# Altium schematic sheet UARTtoRS485.SchDoc
size A
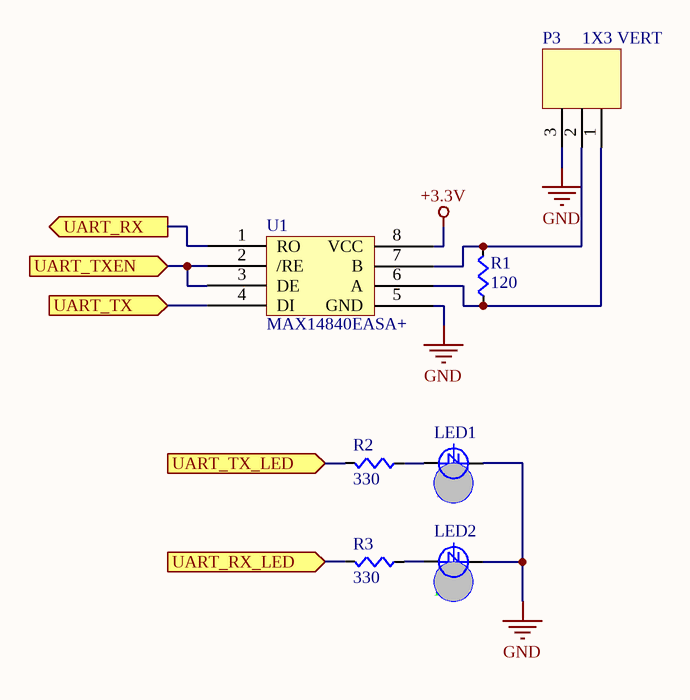
[diagram p0: UARTtoRS485.SchDoc]

## Parts
LED1  Color: TX  [LED0603]  (hidden comment: LED)
LED2  Color: RX  [LED0603]  (hidden comment: LED)
P3  1X3 VERT  [MOLEX-HDR-1X3-SHERLOCK-VERT]
R1  value 120  [RES0603]  (hidden comment: Res)
R2  value 330  [RES0603]  (hidden comment: Res)
R3  value 330  [RES0603]  (hidden comment: Res)
U1  MAX14840EASA+  [MAX14840EASA+]

## Ports
UART_RX (out), UART_RX_LED (in), UART_TX (in), UART_TX_LED (in), UART_TXEN (in)

## Nets
+3.3V: U1.8(VCC)
GND: LED1.C LED2.C P3.3 U1.5(GND)
UART_RX: U1.1(RO) ; port UART_RX
UART_RX_LED: R3.1(A) ; port UART_RX_LED
UART_TX: U1.4(DI) ; port UART_TX
UART_TX_LED: R2.1(A) ; port UART_TX_LED
UART_TXEN: U1.2(/RE) U1.3(DE) ; port UART_TXEN
NetLED1_A: LED1.A R2.2(B)
NetLED2_A: LED2.A R3.2(B)
NetP3_1: P3.1 R1.2(B) U1.6(A)
NetP3_2: P3.2 R1.1(A) U1.7(B)

## Library data of the parts
LED1 = LED: LED RED CLEAR 0603 SMD; Supplier 1: Digi-Key; Supplier Part Number 1: 754-1123-1-ND
LED2 = LED: LED GREEN CLEAR 0603 SMD; Supplier 1: Digi-Key; Supplier Part Number 1: 754-1116-1-ND
P3 = MOLEX-HDR-1x3-SHERLOCK_VERT: CONN HEADER 3POS 2MM VERT TIN; Supplier Part Number 1: WM18921-ND; Supplier 1: Digi-Key
R1 = Res: RES SMD 120 OHM 1% 1/10W 0603; Supplier 1: Digi-Key; Supplier Part Number 1: 311-120HRCT-ND
R2 R3 = Res: RES SMD 330 OHM 1% 1/10W 0603; Supplier 1: Digi-Key; Supplier Part Number 1: 311-330HRCT-ND
U1 = MAX14840EASA+: IC TXRX RS422/485 40MBPS 8SOIC; Supplier 1: Digi-Key; Supplier Part Number 1: MAX14840EASA+-ND